# EAGLE design led_board (EAGLE 6.6.0)
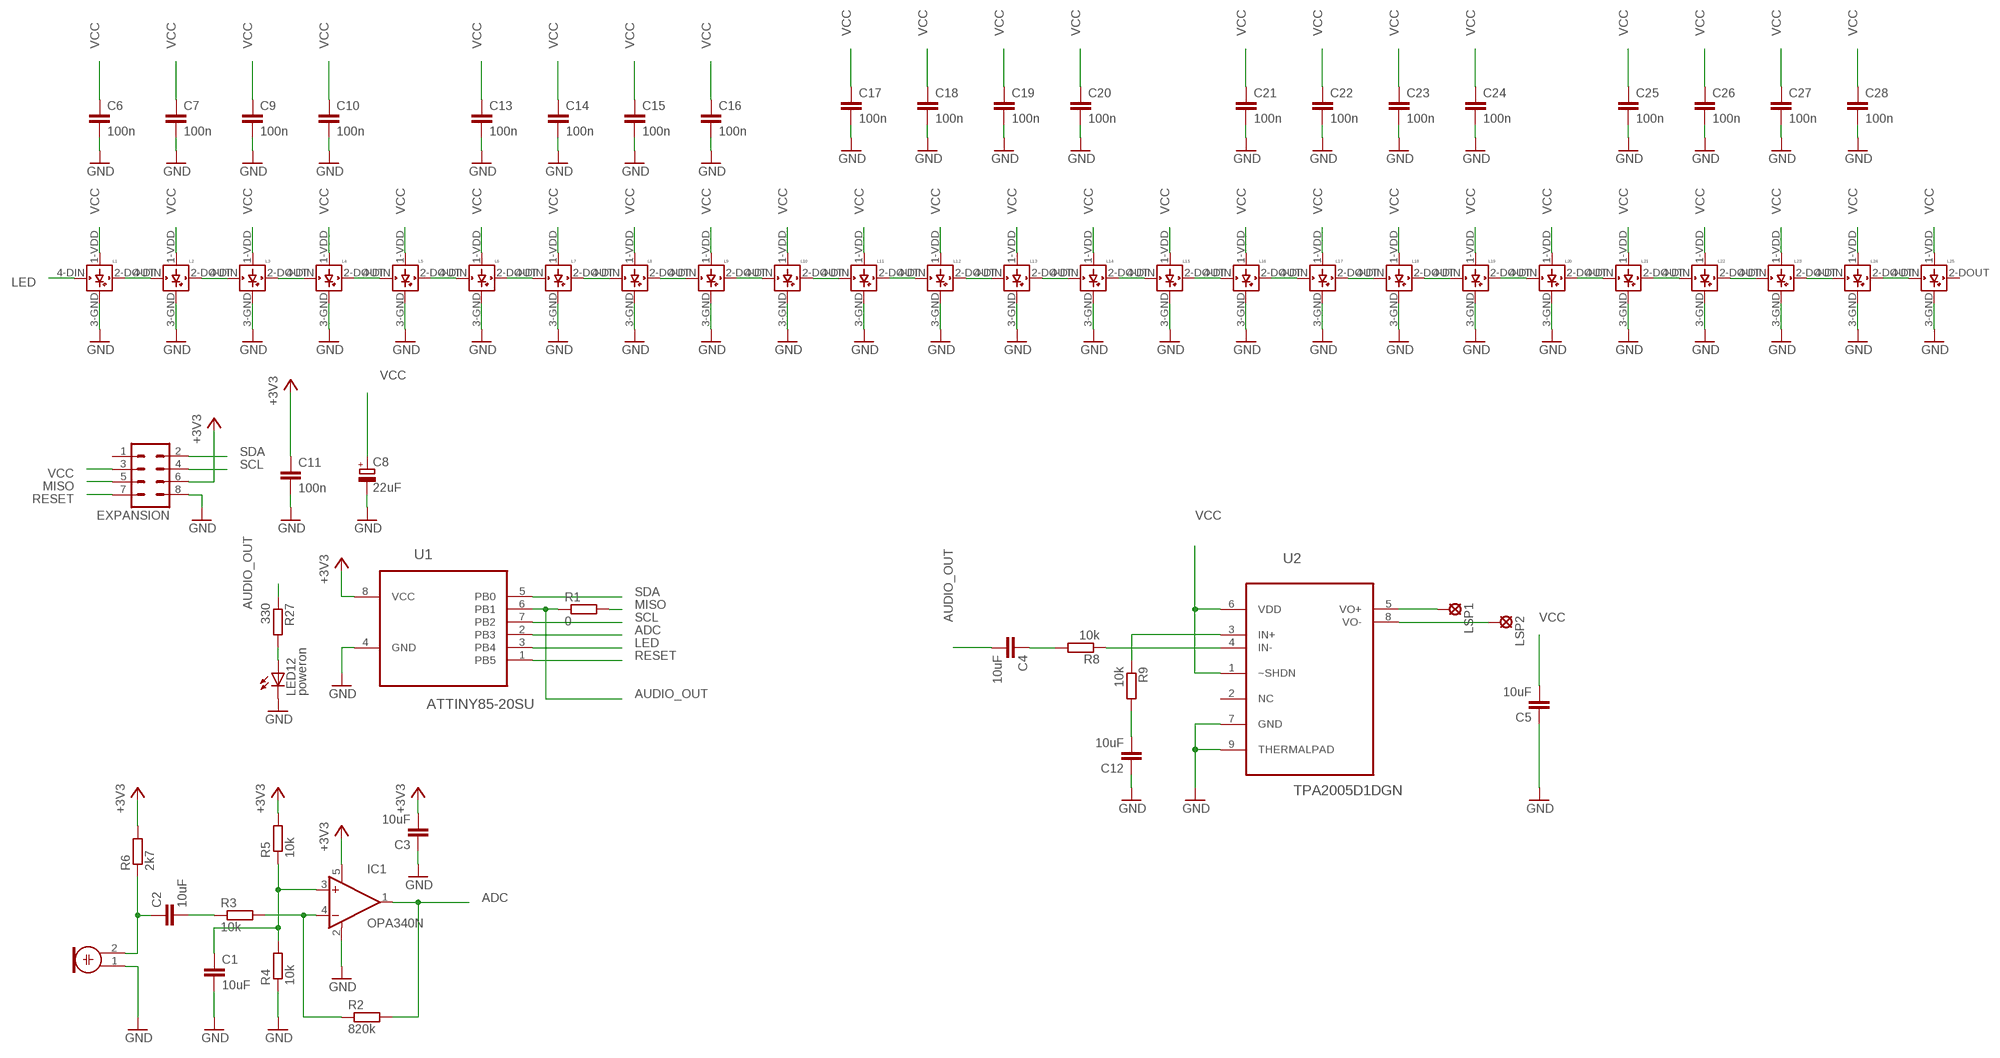
[diagram p0: schematic, sheet 1]

## Parts
C1  10uF  C-EUC0805  [C0805]
C2  10uF  C-EUC0805  [C0805]
C3  10uF  C-EUC0805  [C0805]
C4  10uF  C-EUC0805  [C0805]
C5  10uF  C-EUC0805  [C0805]
C6  100n  C-EUC0805  [C0805]
C7  100n  C-EUC0805  [C0805]
C8  22uF  CPOL-EU153CLV-0505  [153CLV-0505]
C9  100n  C-EUC0805  [C0805]
C10  100n  C-EUC0805  [C0805]
C11  100n  C-EUC0805  [C0805]
C12  10uF  C-EUC0805  [C0805]
C13  100n  C-EUC0805  [C0805]
C14  100n  C-EUC0805  [C0805]
C15  100n  C-EUC0805  [C0805]
C16  100n  C-EUC0805  [C0805]
C17  100n  C-EUC0805  [C0805]
C18  100n  C-EUC0805  [C0805]
C19  100n  C-EUC0805  [C0805]
C20  100n  C-EUC0805  [C0805]
C21  100n  C-EUC0805  [C0805]
C22  100n  C-EUC0805  [C0805]
C23  100n  C-EUC0805  [C0805]
C24  100n  C-EUC0805  [C0805]
C25  100n  C-EUC0805  [C0805]
C26  100n  C-EUC0805  [C0805]
C27  100n  C-EUC0805  [C0805]
C28  100n  C-EUC0805  [C0805]
EXPANSION  MA04-2  [MA04-2]
IC1  OPA340N  [SOT23-5]
L1  WS2812B  [WS2812B]
L2  WS2812B  [WS2812B]
L3  WS2812B  [WS2812B]
L4  WS2812B  [WS2812B]
L5  WS2812B  [WS2812B]
L6  WS2812B  [WS2812B]
L7  WS2812B  [WS2812B]
L8  WS2812B  [WS2812B]
L9  WS2812B  [WS2812B]
L10  WS2812B  [WS2812B]
L11  WS2812B  [WS2812B]
L12  WS2812B  [WS2812B]
L13  WS2812B  [WS2812B]
L14  WS2812B  [WS2812B]
L15  WS2812B  [WS2812B]
L16  WS2812B  [WS2812B]
L17  WS2812B  [WS2812B]
L18  WS2812B  [WS2812B]
L19  WS2812B  [WS2812B]
L20  WS2812B  [WS2812B]
L21  WS2812B  [WS2812B]
L22  WS2812B  [WS2812B]
L23  WS2812B  [WS2812B]
L24  WS2812B  [WS2812B]
L25  WS2812B  [WS2812B]
LED12  poweron  LEDCHIPLED_1206  [CHIPLED_1206]
LSP1  LSP10  [LSP10]
LSP2  LSP10  [LSP10]
M1  ELECTRET_MICROPHON-WM-61B  [WM-61B]
R1  0  R-EU_M0805  [M0805]
R2  820k  R-EU_M0805  [M0805]
R3  10k  R-EU_M0805  [M0805]
R4  10k  R-EU_M0805  [M0805]
R5  10k  R-EU_M0805  [M0805]
R6  2k7  R-EU_M0805  [M0805]
R8  10k  R-EU_M0805  [M0805]
R9  10k  R-EU_M0805  [M0805]
R27  330  R-EU_M0805  [M0805]
U1  ATTINY85-20SU  [SOIC127P798X216-8N]
U2  TPA2005D1DGN  [SOP65P488X107-9N]

## Nets
+3V3: C3.2 C11.1 EXPANSION.6 IC1.5(V+) R5.2 R6.2 U1.8(VCC)
ADC: IC1.1(OUT) R2.2 U1.2(PB3)
AUDIO_OUT: C4.2 R1.1 R27.1 U1.6(PB1)
GND: C1.2 C3.1 C5.1 C6.2 C7.2 C8.- C9.2 C10.2 C11.2 C12.1 C13.2 C14.2 C15.2 C16.2 C17.2 C18.2 C19.2 C20.2 C21.2 C22.2 C23.2 C24.2 C25.2 C26.2 C27.2 C28.2 EXPANSION.8 IC1.2(V-) L1.3-GND(GND) L2.3-GND(GND) L3.3-GND(GND) L4.3-GND(GND) L5.3-GND(GND) L6.3-GND(GND) L7.3-GND(GND) L8.3-GND(GND) L9.3-GND(GND) L10.3-GND(GND) L11.3-GND(GND) L12.3-GND(GND) L13.3-GND(GND) L14.3-GND(GND) L15.3-GND(GND) L16.3-GND(GND) L17.3-GND(GND) L18.3-GND(GND) L19.3-GND(GND) L20.3-GND(GND) L21.3-GND(GND) L22.3-GND(GND) L23.3-GND(GND) L24.3-GND(GND) L25.3-GND(GND) LED12.C M1.1 R4.1 U1.4(GND) U2.7(GND) U2.9(THERMALPAD)
LED: L1.4-DIN(DIN) U1.3(PB4)
LED1: L5.2-DOUT(DOUT) L6.4-DIN(DIN)
LED2: L15.2-DOUT(DOUT) L16.4-DIN(DIN)
LED3: L20.2-DOUT(DOUT) L21.4-DIN(DIN)
MISO: EXPANSION.5 R1.2
N$1: L1.2-DOUT(DOUT) L2.4-DIN(DIN)
N$2: L2.2-DOUT(DOUT) L3.4-DIN(DIN)
N$3: L3.2-DOUT(DOUT) L4.4-DIN(DIN)
N$4: L4.2-DOUT(DOUT) L5.4-DIN(DIN)
N$5: LSP1.MP U2.5(VO+)
N$6: L6.2-DOUT(DOUT) L7.4-DIN(DIN)
N$7: L7.2-DOUT(DOUT) L8.4-DIN(DIN)
N$8: L8.2-DOUT(DOUT) L9.4-DIN(DIN)
N$9: L9.2-DOUT(DOUT) L10.4-DIN(DIN)
N$13: L11.2-DOUT(DOUT) L12.4-DIN(DIN)
N$14: L12.2-DOUT(DOUT) L13.4-DIN(DIN)
N$15: L13.2-DOUT(DOUT) L14.4-DIN(DIN)
N$16: L14.2-DOUT(DOUT) L15.4-DIN(DIN)
N$17: L16.2-DOUT(DOUT) L17.4-DIN(DIN)
N$18: L17.2-DOUT(DOUT) L18.4-DIN(DIN)
N$19: L18.2-DOUT(DOUT) L19.4-DIN(DIN)
N$20: L19.2-DOUT(DOUT) L20.4-DIN(DIN)
N$21: L10.2-DOUT(DOUT) L11.4-DIN(DIN)
N$22: L21.2-DOUT(DOUT) L22.4-DIN(DIN)
N$23: LED12.A R27.2
N$24: L22.2-DOUT(DOUT) L23.4-DIN(DIN)
N$25: L23.2-DOUT(DOUT) L24.4-DIN(DIN)
N$26: L24.2-DOUT(DOUT) L25.4-DIN(DIN)
N$27: C2.2 R3.1
N$28: IC1.4(-IN) R2.1 R3.2
N$29: C2.1 M1.2 R6.1
N$30: C1.1 IC1.3(+IN) R4.2 R5.1
N$31: R8.1 U2.4(IN-)
N$32: LSP2.MP U2.8(VO-)
N$33: C4.1 R8.2
N$34: C12.2 R9.2
N$36: R9.1 U2.3(IN+)
RESET: EXPANSION.7 U1.1(PB5)
SCL: EXPANSION.4 U1.7(PB2)
SDA: EXPANSION.2 U1.5(PB0)
VCC: C5.2 C6.1 C7.1 C8.+ C9.1 C10.1 C13.1 C14.1 C15.1 C16.1 C17.1 C18.1 C19.1 C20.1 C21.1 C22.1 C23.1 C24.1 C25.1 C26.1 C27.1 C28.1 EXPANSION.3 L1.1-VDD(VDD) L2.1-VDD(VDD) L3.1-VDD(VDD) L4.1-VDD(VDD) L5.1-VDD(VDD) L6.1-VDD(VDD) L7.1-VDD(VDD) L8.1-VDD(VDD) L9.1-VDD(VDD) L10.1-VDD(VDD) L11.1-VDD(VDD) L12.1-VDD(VDD) L13.1-VDD(VDD) L14.1-VDD(VDD) L15.1-VDD(VDD) L16.1-VDD(VDD) L17.1-VDD(VDD) L18.1-VDD(VDD) L19.1-VDD(VDD) L20.1-VDD(VDD) L21.1-VDD(VDD) L22.1-VDD(VDD) L23.1-VDD(VDD) L24.1-VDD(VDD) L25.1-VDD(VDD) U2.1(~SHDN) U2.6(VDD)
Unconnected: EXPANSION.1 L25.2-DOUT(DOUT) U2.2(NC)

## Library data of the parts
C1-C7 C9-C28 = resistor:C-EU: CAPACITOR, European symbol
C8 = resistor:CPOL-EU: POLARIZED CAPACITOR, European symbol
EXPANSION = con-lstb:MA04-2: PIN HEADER; OC_FARNELL: unknown; OC_NEWARK: unknown
IC1 = burr-brown:OPA340: Rail-to-Rail Operational Amplifiers Single-Supply, MicroAmplifier(TM) Series; MPN: OPA340NA/3KG4; OC_FARNELL: 1234805; OC_NEWARK: 13M5177
L1-L25 = adafruit:WS2812B
LED12 = led:LED: LED OSRAM: - CHIPLED LG R971, LG N971, LY N971, LG Q971, LY Q971, LO R971, LY R971 LH N974, LH R974 LS Q976, LO Q976, LY Q976 LO Q996 - Hyper CHIPLED LW Q18S LB Q993, LB Q99A, LB R99A - SideLED LS A670, LO A670, LY A670, LG A670, LP A670 LB A673, LV A673, LT A673, LW A673 LH A674 LY A675 LS A676, LA A676, LO A676, LY A676, LW A676 LS A679, LY A679, LG A679 - Hyper Micro SIDELED® LS Y876, LA Y876, LO Y876, LY Y876 LT Y87S - SmartLED LW L88C, LW L88S LB L89C, LB L89S, LG L890 LS L89K, LO L89K, LY L89K LS L896, LA L896, LO L896, LY L896 - TOPLED LS T670, LO T670, LY T670, LG T670, LP T670 LSG T670, LSP T670, LSY T670, LOP T670, LYG T670 LG T671, LOG T671, LSG T671 LB T673, LV T673, LT T673, LW T673 LH T674 LS T676, LA T676, LO T676, LY T676, LB T676, LH T676, LSB T676, LW T676 LB T67C, LV T67C, LT T67C, LS T67K, LO T67K, LY T67K, LW E67C LS E67B, LA E67B, LO E67B, LY E67B, LB E67C, LV E67C, LT E67C LW T67C LS T679, LY T679, LG T679 LS T770, LO T770, LY T770, LG T770, LP T770 LB T773, LV T773, LT T773, LW T773 LH T774 LS E675, LA E675, LY E675, LS T675 LS T776, LA T776, LO T776, LY T776, LB T776 LHGB T686 LT T68C, LB T68C - Hyper Mini TOPLED® LB M676 - Mini TOPLED Santana® LG M470 LS M47K, LO M47K, LY M47K Source: http://www.osram.convergy.de LUXEON: - LUMILED® LXK2-PW12-R00, LXK2-PW12-S00, LXK2-PW14-U00, LXK2-PW14-V00 LXK2-PM12-R00, LXK2-PM12-S00, LXK2-PM14-U00 LXK2-PE12-Q00, LXK2-PE12-R00, LXK2-PE12-S00, LXK2-PE14-T00, LXK2-PE14-U00 LXK2-PB12-K00, LXK2-PB12-L00, LXK2-PB12-M00, LXK2-PB14-N00, LXK2-PB14-P00, LXK2-PB14-Q00 LXK2-PR12-L00, LXK2-PR12-M00, LXK2-PR14-Q00, LXK2-PR14-R00 LXK2-PD12-Q00, LXK2-PD12-R00, LXK2-PD12-S00 LXK2-PH12-R00, LXK2-PH12-S00 LXK2-PL12-P00, LXK2-PL12-Q00, LXK2-PL12-R00 Source: www.luxeon.com KINGBRIGHT: KA-3528ASYC Source: www.kingbright.com
LSP1 LSP2 = solpad:LSP10: SOLDER PAD drill 1.0 mm, distributor Buerklin, 12H555
M1 = microphon:ELECTRET_MICROPHON-: Electret Condenser Microphone
R1-R6 R8 R9 R27 = resistor:R-EU_: RESISTOR, European symbol
U1 = my_parts:ATTINY85-20SU: 8-bit Microcontroller with In-System Programmable Flash; MPN: ATTINY85-20SU; OC_FARNELL: 1455164; OC_NEWARK: 58M3797; PACKAGE: SOIC-8; SUPPLIER: Atmel
U2 = my_parts:TPA2005D1DGN: 1.4-W MONO FILTER-FREE CLASS-D AUDIO POWER AMPLIFIER; MPN: TPA2005D1DGN; OC_FARNELL: 2075395; OC_NEWARK: 82T3159; PACKAGE: MSOP-8; SUPPLIER: Texas Instruments

## Board
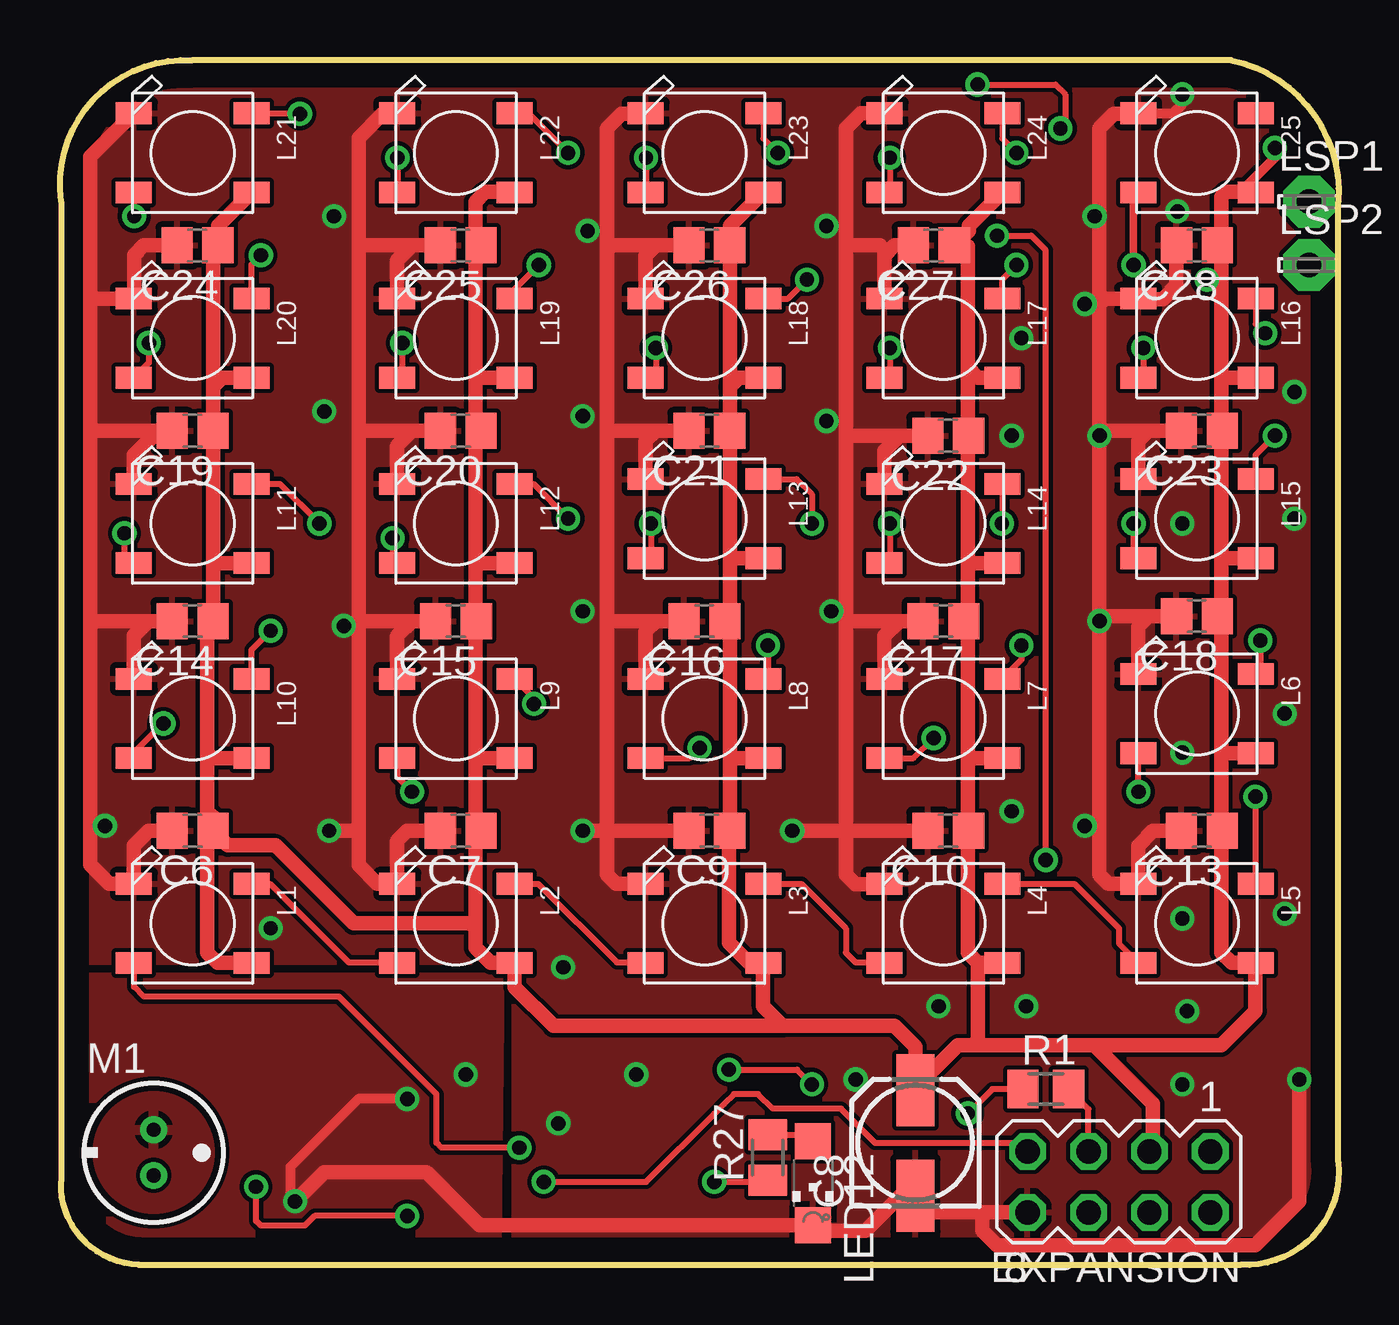
[diagram p1: board, top side]
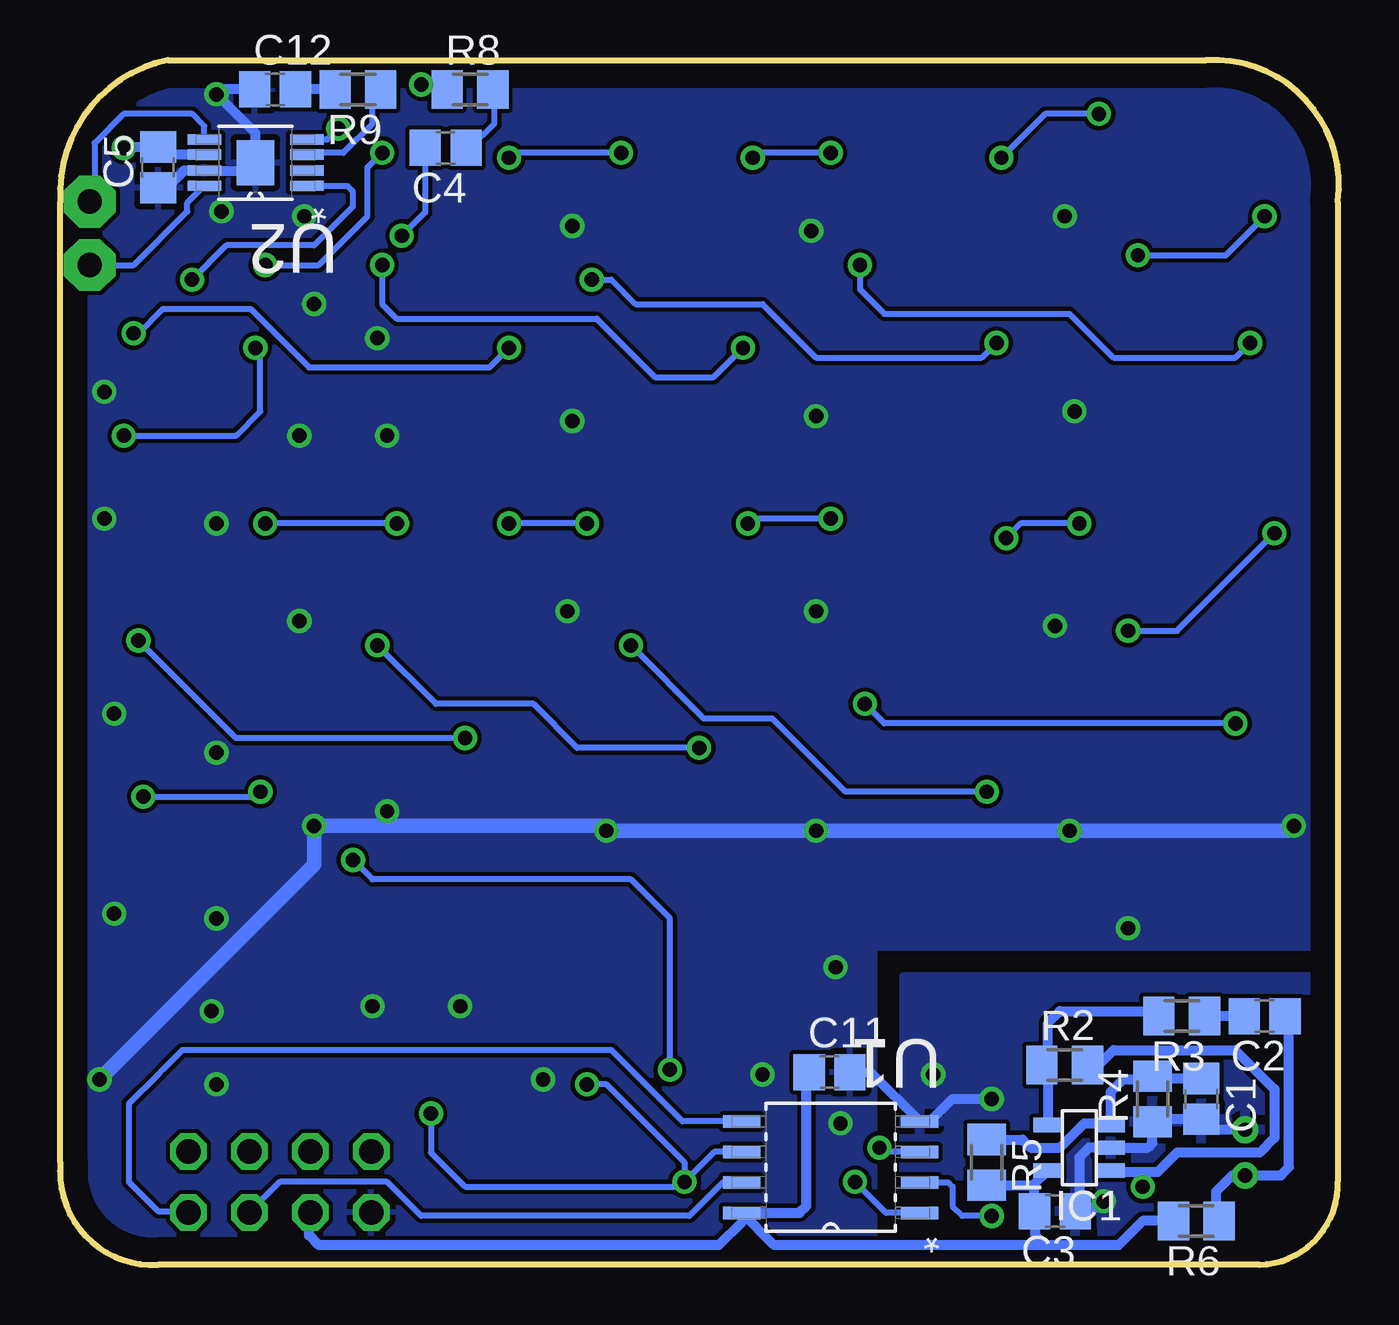
[diagram p2: board, bottom side, seen from below]

Size 53.3 x 50.2 mm. Coordinates in mm from the lower left corner, seen from the top.
Outline: 3.29,0 49.22,0 arc99 53.28,4.27 53.28,44.3 arc82 48.81,50.19 5.53,50.19 arc101 0.04,44.3 0.04,3.46 arc90 3.29,0
Copper layers (1*16): Top 0.035mm / dielectric 1.5mm / Bottom 0.035mm
Design rules "default *": minimum track width 7mil, minimum drill 24mil, track to track 7mil, track to pad 7mil, pad to pad 7mil, via to via 7mil, smd to smd 7mil, copper to edge 40mil, drill to drill 8mil, minimum pad ring 10mil, minimum via ring 8mil, stop-mask expansion 4mil, vias tented up to drill 0mil, thermal gap 10mil

### Footprints (pad centres in the part's own frame; a part is rotated, then mirrored left to right if it is on the bottom)
C0805 = smd 1.3 x 1.5: 1 -0.85,0; 2 0.85,0
153CLV-0505 = smd 3 x 1.6: + 2.2,0; - -2.2,0
MA04-2 = drill 1.016 octagon: 1 -3.81,-1.27; 2 -3.81,1.27; 3 -1.27,-1.27; 4 -1.27,1.27; 5 1.27,-1.27; 6 1.27,1.27; 7 3.81,-1.27; 8 3.81,1.27
SOT23-5 = smd 0.6 x 1.2: 1 -0.95,-1.306; 2 0,-1.306; 3 0.95,-1.306; 4 0.95,1.306; 5 -0.95,1.306
WS2812B = smd 1.5 x 0.9: 1-VDD 2.45,-1.65; 2-DOUT 2.45,1.65; 3-GND -2.45,1.65; 4-DIN -2.45,-1.65
CHIPLED_1206 = smd 1.5 x 1.5: A 0,-1.75; C 0,1.75
LSP10 = drill 1.016 pad 2.159 octagon: MP 0,0
WM-61B = drill 0.6 pad 1: 1 0,0.95; 2 0,-0.95
M0805 = smd 1.3 x 1.6: 1 -0.95,0; 2 0.95,0
SOIC127P798X216-8N = smd 1.549 x 0.533: 1 -3.708,1.905; 2 -3.708,0.635; 3 -3.708,-0.635; 4 -3.708,-1.905; 5 3.708,-1.905; 6 3.708,-0.635; 7 3.708,0.635; 8 3.708,1.905
SOP65P488X107-9N = smd 1.397 x 0.432: 1 -2.134,0.965; 2 -2.134,0.33; 3 -2.134,-0.33; 4 -2.134,-0.965; 5 2.134,-0.965; 6 2.134,-0.33; 7 2.134,0.33; 8 2.134,0.965 | smd 1.575 x 1.88: 9 0,0

### Placement (x,y rotation side)
C1  5.73,6.91 270 bottom
C2  3.09,10.37 180 bottom
C3  11.83,2.24 180 bottom
C4  37.23,46.54 180 bottom
C5  49.22,45.72 90 bottom
C6  5.53,18.09 180 top
C7  16.71,18.09 180 top
C8  35.65,5.08 90 top
C9  27.07,18.09 180 top
C10  37.03,18.09 180 top
C11  21.23,8.03 0 bottom
C12  44.34,48.97 0 bottom
C13  47.59,18.09 180 top
C14  5.53,26.82 180 top
C15  16.5,26.82 180 top
C16  26.87,26.82 180 top
C17  36.82,26.82 180 top
C18  47.39,27.03 180 top
C19  5.53,34.75 180 top
C20  16.71,34.75 180 top
C21  27.07,34.75 180 top
C22  37.03,34.55 180 top
C23  47.59,34.75 180 top
C24  5.73,42.47 180 top
C25  16.71,42.47 180 top
C26  27.07,42.47 180 top
C27  36.42,42.47 180 top
C28  47.39,42.47 180 top
EXPANSION  44.14,3.46 180 top
IC1  10.81,4.88 90 bottom
L1  5.53,14.23 0 top
L2  16.5,14.23 0 top
L3  26.87,14.23 0 top
L4  36.82,14.23 0 top
L5  47.39,14.23 0 top
L6  47.39,22.96 0 top
L7  36.82,22.76 0 top
L8  26.87,22.76 0 top
L9  16.5,22.76 0 top
L10  5.53,22.76 0 top
L11  5.53,30.89 0 top
L12  16.5,30.89 0 top
L13  26.87,31.09 0 top
L14  36.82,30.89 0 top
L15  47.39,31.09 0 top
L16  47.39,38.61 0 top
L17  36.82,38.61 0 top
L18  26.87,38.61 0 top
L19  16.5,38.61 0 top
L20  5.53,38.61 0 top
L21  5.53,46.33 0 top
L22  16.5,46.33 0 top
L23  26.87,46.33 0 top
L24  36.82,46.33 0 top
L25  47.39,46.33 0 top
LED12  31.39,3.41 180 top
LSP1  52.06,44.3 0 top
LSP2  52.06,41.66 0 top
M1  3.9,4.68 0 top
R1  41.09,7.32 0 top
R2  11.42,8.33 0 bottom
R3  6.55,10.37 180 bottom
R4  7.77,6.91 90 bottom
R5  14.67,4.27 270 bottom
R6  5.94,1.83 180 bottom
R8  36.21,48.97 0 bottom
R9  40.89,48.97 180 bottom
R27  29.51,4.47 90 top
U1  21.18,4.07 180 bottom
U2  45.15,45.93 180 bottom

### Tracks (layer width: path | path; a pad name or v marks a point on that pad's centre or on a via)
+3V3
  Bottom 0.406: R6.2 8.17,1.83 9.19,0.82 12.24,0.82 | 12.24,0.82 12.64,1.22 12.64,2.2 C3.2 12.68,3.37 | 12.68,3.37 IC1.5 | R5.2 12.73,3.32 12.68,3.37 | 12.24,0.82 23.54,0.82 U1.8 | U1.8 22.47,2.16 22.19,2.44 22.19,7.91 C11.1 | U1.8 24.88,1.78 25.85,0.82 42.51,0.82 42.92,1.22 42.92,2.14 EXPANSION.6
ADC  (via drill 0.6)
  Top 0.254: v14.47,2.03 10.61,2.03 10.2,1.63 8.37,1.63 8.17,1.83 v8.17,3.25
  Bottom 0.254: v8.17,3.25 8.17,3.46 8.58,3.86 | v14.47,2.03 15.69,2.03 16.1,2.44 16.1,3.25 16.27,3.43 U1.2
  Bottom 0.406: R2.2 10,8.33 9.39,8.94 4.31,8.94 2.69,7.32 2.69,5.29 3.29,4.68 6.75,4.68 7.56,3.86 8.58,3.86 9.44,3.86 IC1.1
AUDIO_OUT  (via drill 0.6)
  Top 0.254: v27.27,3.46 29.44,3.46 R27.1 | R1.1 38.85,7.32 v37.84,6.3 | v31.34,7.52 30.73,8.13 v27.88,8.13 | v39.06,42.88 40.48,42.88 41.09,42.27 v41.09,16.87
  Bottom 0.254: U1.6 26.03,4.7 v27.27,3.46 | v27.27,3.46 27.27,4.27 30.52,7.52 v31.34,7.52 | v37.84,6.3 37.84,4.68 36.42,3.25 27.48,3.25 v27.27,3.46 | v27.88,8.13 27.88,14.43 29.51,16.06 40.28,16.06 v41.09,16.87 | C4.2 38.08,43.86 v39.06,42.88
GND  (via drill 0.6)
  Top 0.406: v14.47,6.91 12.44,6.91 9.59,4.07 9.59,2.85 v9.8,2.64 | v46.78,48.77 46.78,48.36 46.37,47.96 44.96,47.96 L25.3-GND
  Top 0.61: EXPANSION.8 38.45,2.19 | 38.45,2.19 36.35,2.19 C8.- 35.03,2.88 33.57,1.42 31.62,1.42 LED12.C 17.49,1.66 15.28,3.86 11.02,3.86 v9.8,2.64 | 1.26,18.29 1.26,16.66 2.05,15.88 L1.3-GND 3.08,17.47 3.7,18.09 C6.2 | 1.26,18.29 1.26,26.62 | 1.26,26.62 1.26,34.55 | 1.26,34.55 1.26,40.24 | 1.26,40.24 1.26,46.16 L21.3-GND | 1.26,40.24 1.29,40.26 L20.3-GND 3.09,42.06 3.5,42.47 C24.2 | C19.2 4.11,34.75 | 4.11,34.75 1.47,34.75 1.26,34.55 | L11.3-GND 3.08,33.72 4.11,34.75 | C14.2 3.7,26.82 | 3.7,26.82 1.47,26.82 1.26,26.62 | L10.3-GND 3.08,26.2 3.7,26.82 | 12.44,18.09 12.44,16.66 13.23,15.88 L2.3-GND 14.05,17.67 14.47,18.09 C7.2 | 12.44,18.09 12.44,26.82 | 12.44,26.82 12.44,34.75 | 12.44,34.75 12.44,42.27 | 12.44,42.27 12.44,46.94 13.45,47.96 14.03,47.96 L22.3-GND | L19.3-GND 14.05,41.85 14.67,42.47 | 14.67,42.47 C25.2 | 14.67,42.47 12.64,42.47 12.44,42.27 | C20.2 14.67,34.75 | 14.67,34.75 12.44,34.75 | L12.3-GND 14.05,34.13 14.67,34.75 | L9.3-GND 14.05,26.2 14.67,26.82 C15.2 12.44,26.82 | L3.3-GND 23.18,15.88 22.8,16.26 22.8,18.09 | 22.8,18.09 22.8,18.29 | 22.8,18.29 22.8,26.82 | 22.8,26.82 22.8,34.55 | 22.8,34.55 22.8,42.27 | 22.8,42.27 22.8,47.35 23.41,47.96 24.39,47.96 L23.3-GND | L18.3-GND 24.42,42.05 24.83,42.47 C26.2 23.01,42.47 22.8,42.27 | L13.3-GND 24.42,34.33 24.83,34.75 C21.2 23.01,34.75 22.8,34.55 | L8.3-GND 24.42,26.41 24.83,26.82 C16.2 22.8,26.82 | C9.2 22.8,18.09 | L24.3-GND 33.39,47.98 32.76,47.35 32.76,42.47 | 32.76,42.47 32.76,34.55 | 32.76,34.55 32.76,26.82 | 32.76,26.82 32.76,18.09 | 32.76,18.09 32.76,16.26 33.17,15.85 34.35,15.85 L4.3-GND | C10.2 32.76,18.09 | 43.33,18.29 43.33,16.26 43.71,15.88 L5.3-GND 44.94,17.47 45.56,18.09 C13.2
  Top 0.61: 43.33,18.29 43.33,27.03 | 43.33,27.03 43.33,34.75 | 43.33,34.75 43.33,40.03 | 43.33,40.03 43.33,47.35 43.93,47.96 44.91,47.96 L25.3-GND | L15.3-GND 44.94,34.33 45.36,34.75 C23.2 43.33,34.75 | L6.3-GND 44.94,26.61 45.36,27.03 C18.2 43.33,27.03 | v21.79,18.09 22.6,18.09 22.8,18.29 | v11.22,18.09 12.44,18.09 | v1.87,18.29 1.26,18.29 | v42.72,18.29 43.33,18.29 | v30.52,18.09 32.76,18.09 | L7.3-GND 34.37,26.2 34.99,26.82 C17.2 32.76,26.82 | L14.3-GND 34.37,33.93 34.99,34.55 | 34.99,34.55 C22.2 | 34.99,34.55 32.76,34.55 | C27.2 34.79,42.47 34.37,42.05 L17.3-GND 34.37,42.28 34.18,42.47 32.76,42.47 | v51.66,7.72 51.66,2.64 49.83,0.82 39.06,0.82 38.45,1.42 38.45,2.19 | 43.33,40.03 43.55,40.26 L16.3-GND 44.96,40.24 45.97,40.24 46.54,40.81 C28.2
  Bottom 0.406: M1.1 5.3,5.63 C1.2 7.67,6.06 R4.1 7.77,5.08 7.97,4.88 IC1.2 10.41,4.88 10.81,4.47 10.81,2.4 | 10.81,2.4 C3.1 | v14.47,6.91 16.1,6.91 17.04,5.97 U1.4 19.53,8.03 C11.2 | 10.81,2.4 10.04,2.4 v9.8,2.64 | C5.1 48.98,45.11 48.61,45.11 48.13,45.6 U2.7 45.48,45.6 U2.9 45.15,47.14 v46.78,48.77 46.58,48.97 C12.1
  Bottom 0.61: v1.87,18.29 2.08,18.09 v11.22,18.09 v21.79,18.09 v30.52,18.09 30.73,18.29 v42.72,18.29 42.72,16.66 v51.66,7.72
  other vias: 16.91,7.93 42.72,40.03 40.07,38.61 39.67,34.55 43.33,34.55 51.45,36.38 51.45,31.09 46.78,30.89 51.05,22.96 46.78,21.34 51.05,14.63 46.78,14.43 43.12,43.69 24.02,7.93 20.77,5.9 33.17,7.72 40.28,10.77 46.98,10.57 36.62,10.77 46.78,7.52 46.58,43.89 20.97,12.4 8.78,14.02 11.83,26.62 21.79,27.23 21.79,35.36 11.02,35.56 11.42,43.69 21.99,43.08 31.95,43.28 31.95,35.16 32.15,27.23 43.33,26.82 39.67,18.9
  pour Bottom: -0.97,11.99 18.13,11.99 18.13,-8.13 -0.97,-8.13
  pour Top: -1.18,11.99 18.33,11.99 18.13,-4.47 -1.38,-4.47
  pour Bottom: -2.8,55.07 55.72,55.07 55.72,13.21 -2.8,13.21
  pour Top: -6.46,53.65 56.74,53.65 56.74,12.6 -6.46,12.6
  pour Bottom: 19.35,14.23 54.7,14.23 54.7,-4.06 19.35,-4.06
  pour Top: 18.94,16.87 53.69,16.87 53.69,-4.26 18.94,-4.26
LED  (via drill 0.6)
  Top 0.254: v19.14,4.88 15.89,4.88 15.69,5.08 15.69,7.11 11.63,11.18 3.5,11.18 3.09,11.58 L1.4-DIN
  Bottom 0.254: U1.3 18.97,4.7 v19.14,4.88
LED1  (via drill 0.6)
  Top 0.254: L5.2-DOUT 49.84,19.5 v49.83,19.51 | v44.95,19.71 L6.4-DIN
  Bottom 0.254: v49.83,19.51 45.15,19.51 v44.95,19.71
LED2  (via drill 0.6)
  Top 0.254: L15.2-DOUT 49.84,33.75 v50.64,34.55 | v45.15,38.2 45.15,37.18 L16.4-DIN
  Bottom 0.254: v50.64,34.55 45.97,34.55 44.95,35.56 44.95,38 v45.15,38.2
LED3  (via drill 0.6)
  Top 0.254: L20.2-DOUT 7.98,41.67 v8.37,42.06 | v3.09,43.69 3.09,44.67 L21.4-DIN
  Bottom 0.254: v8.37,42.06 4.72,42.06 v3.09,43.69
MISO
  Top 0.254: EXPANSION.5 42.87,6.49 R1.2
N$1
  Top 0.254: L1.2-DOUT 8.76,15.88 12.03,12.6 14.03,12.6 L2.4-DIN
N$2
  Top 0.254: L2.2-DOUT 19.93,15.88 23.21,12.6 24.39,12.6 L3.4-DIN
N$3
  Top 0.254: L3.2-DOUT 30.91,15.88 32.76,14.02 32.76,13.01 33.17,12.6 34.35,12.6 L4.4-DIN
N$4
  Top 0.254: L4.2-DOUT 42.28,15.88 44.14,14.02 44.14,13.38 L5.4-DIN
N$5
  Bottom 0.254: U2.5 47.29,47.45 47.8,47.96 50.64,47.96 51.86,46.74 51.86,44.5 LSP1.MP
N$6  (via drill 0.6)
  Top 0.254: L7.4-DIN 35.58,21.11 v36.42,21.95 | v50.03,26.01 50.03,24.81 L6.2-DOUT
  Bottom 0.254: v36.42,21.95 45.97,21.95 v50.03,26.01
N$7  (via drill 0.6)
  Top 0.254: L8.4-DIN 26.23,21.11 v26.66,21.54 | v40.07,25.81 40.07,25.21 L7.2-DOUT
  Bottom 0.254: v26.66,21.54 31.74,21.54 33.57,23.37 37.64,23.37 v40.07,25.81
N$8  (via drill 0.6)
  Top 0.254: L9.4-DIN 14.05,20.33 v14.67,19.71 | v29.51,25.81 29.51,24.6 L8.2-DOUT
  Bottom 0.254: v14.67,19.71 20.57,19.71 23.61,22.76 26.46,22.76 v29.51,25.81
N$9  (via drill 0.6)
  Top 0.254: L10.4-DIN 3.08,21.33 v4.31,22.56 | v19.75,23.37 19.75,23.61 L9.2-DOUT
  Bottom 0.254: v4.31,22.56 18.94,22.56 v19.75,23.37
N$13  (via drill 0.6)
  Top 0.254: L11.2-DOUT 9.16,32.54 v10.81,30.89 | v13.86,30.28 13.86,29.43 L12.4-DIN
  Bottom 0.254: v10.81,30.89 13.25,30.89 v13.86,30.28
N$14  (via drill 0.6)
  Top 0.254: L12.2-DOUT 19.73,32.54 v21.18,31.09 | v24.63,30.89 24.63,29.66 L13.4-DIN
  Bottom 0.254: v21.18,31.09 24.43,31.09 v24.63,30.89
N$15  (via drill 0.6)
  Top 0.254: L13.2-DOUT 30.7,32.74 31.34,32.11 v31.34,30.89 | v34.59,30.89 34.59,29.45 L14.4-DIN
  Bottom 0.254: v31.34,30.89 v34.59,30.89
N$16  (via drill 0.6)
  Top 0.254: L14.2-DOUT v39.27,30.9 v39.26,30.89 | v44.75,30.89 44.75,29.63 L15.4-DIN
  Bottom 0.254: v39.26,30.89 v44.75,30.89
N$17  (via drill 0.6)
  Top 0.254: L16.2-DOUT 49.84,39.21 v50.23,38.81 | v34.59,38.2 34.59,37.18 L17.4-DIN
  Bottom 0.254: v50.23,38.81 50.03,38.81 49.01,39.83 45.36,39.83 42.92,37.39 35.4,37.39 v34.59,38.2
N$18  (via drill 0.6)
  Top 0.254: L17.2-DOUT 39.27,41.06 v39.87,41.66 | v24.83,38.2 24.83,37.38 L18.4-DIN
  Bottom 0.254: v39.87,41.66 39.87,40.03 39.26,39.42 30.93,39.42 28.49,36.98 26.05,36.98 v24.83,38.2
N$19  (via drill 0.6)
  Top 0.254: L18.2-DOUT 30.34,40.26 v31.13,41.05 | v14.27,38.41 14.27,37.18 L19.4-DIN
  Bottom 0.254: v31.13,41.05 30.32,41.05 29.3,40.03 24.02,40.03 21.79,37.8 14.88,37.8 v14.27,38.41
N$20  (via drill 0.6)
  Top 0.254: L19.2-DOUT 18.95,40.65 v19.96,41.66 | v3.7,38.41 3.7,37.58 L20.4-DIN
  Bottom 0.254: v19.96,41.66 19.96,40.64 18.94,39.63 11.22,39.63 9.39,37.8 4.31,37.8 v3.7,38.41
N$21  (via drill 0.6)
  Top 0.254: L10.2-DOUT 7.98,25.62 v8.78,26.42 | v2.69,30.48 2.69,29.63 L11.4-DIN
  Bottom 0.254: v8.78,26.42 6.75,26.42 v2.69,30.48
N$22  (via drill 0.6)
  Top 0.254: L21.2-DOUT 9.98,47.98 v10,47.96 | v14.06,46.13 14.06,44.69 L22.4-DIN
  Bottom 0.254: v10,47.96 12.24,47.96 v14.06,46.13
N$23
  Top 0.254: R27.2 31.12,5.42 LED12.A
N$24  (via drill 0.6)
  Top 0.254: L22.2-DOUT 19.53,47.98 v21.18,46.33 | v24.43,46.13 24.43,44.69 L23.4-DIN
  Bottom 0.254: v21.18,46.33 24.22,46.33 v24.43,46.13
N$25  (via drill 0.6)
  Top 0.254: L23.2-DOUT 29.32,46.93 v29.91,46.33 | v34.59,46.13 34.59,44.9 L24.4-DIN
  Bottom 0.254: v29.91,46.33 34.38,46.33 v34.59,46.13
N$26  (via drill 0.6)
  Top 0.254: L24.2-DOUT 39.27,46.93 v39.87,46.33 | 45.12,44.5 L25.4-DIN
  Top 0.305: v44.75,41.66 44.75,44.49 L25.4-DIN
  Bottom 0.254: v44.75,41.66 42.51,41.66 40.48,43.69 40.48,45.72 v39.87,46.33
N$27
  Bottom 0.406: C2.2 R3.1
N$28
  Bottom 0.406: 12.12,8.08 R2.1 | 12.12,8.08 IC1.4 | 12.12,8.08 12.12,10.08 11.63,10.57 7.7,10.57 R3.2
N$29
  Bottom 0.406: R6.1 5.12,1.97 5.12,3.05 4.45,3.73 M1.2 2.42,3.73 2.08,4.07 2.08,10.2 C2.1
N$30
  Bottom 0.406: C1.1 7.67,7.76 R4.2 7.9,7.72 8.98,7.72 9.51,7.2 IC1.3 9.57,5.9 10.61,5.9 11.63,4.88 12.85,4.88 13.19,5.22 R5.1
N$31  (via drill 0.6)
  Top 0.254: v38.25,49.18 41.5,49.18 41.9,48.77 41.9,47.55 v41.7,47.35
  Bottom 0.254: v38.25,49.18 37.37,49.18 R8.1 | U2.4 42.16,46.89 v41.7,47.35
N$32
  Bottom 0.254: LSP2.MP 50.23,41.66 48,43.89 48,44.25 U2.8
N$33
  Bottom 0.254: C4.1 36.21,46.54 35.2,47.55 35.2,48.91 R8.2
N$34
  Bottom 0.406: R9.2 C12.2
N$36
  Bottom 0.254: R9.1 40.28,48.63 40.28,47.55 41.5,46.33 42.94,46.33 U2.3
RESET  (via drill 0.6)
  Top 0.254: v20.16,3.46 24.43,3.46 27.27,6.3 27.68,6.71 28.09,7.11 29.1,7.11 29.71,6.5 32.56,6.5 33.98,5.08 39.97,5.08 EXPANSION.7
  Bottom 0.254: U1.1 18.86,2.16 v20.16,3.46
SCL
  Bottom 0.254: U1.7 25.67,3.43 27.07,2.03 38.25,2.03 39.67,3.46 44.14,3.46 EXPANSION.4
SDA
  Bottom 0.254: U1.5 27.35,5.97 30.32,8.94 48.2,8.94 49.01,8.13 49.22,7.93 50.44,6.71 50.44,3.46 49.22,2.24 48,2.24 EXPANSION.2
VCC  (via drill 0.6)
  Top 0.254: v47.8,41.05 48.41,41.05
  Top 0.406: v50.64,46.54 50.64,46.13 49.22,44.71
  Top 0.61: C8.+ 35.65,7.37 | 35.65,7.37 37.43,9.15 38.04,9.15 | 38.04,9.15 43.12,9.15 | 43.12,9.15 45.56,6.71 45.56,4.88 EXPANSION.3 | C6.1 6.14,17.85 6.14,13.01 6.57,12.58 L1.1-VDD 8.35,12.58 | L10.1-VDD 6.37,21.11 6.14,21.34 | 6.14,21.34 6.14,26.58 C14.1 6.38,29.26 | C6.1 6.38,18.66 6.14,18.9 6.14,21.34 | 6.38,29.26 C19.1 6.38,36.58 | L11.1-VDD 6.4,29.24 6.38,29.26 | 6.38,36.58 6.38,42.27 C24.1 6.58,43.29 L21.1-VDD | L20.1-VDD 6.76,36.96 6.38,36.58 | 17.32,14.02 17.32,13.21 17.95,12.58 L2.1-VDD 18.95,11.57 20.57,9.96 30.12,9.96 | 17.32,14.02 17.32,17.88 | 17.32,17.88 17.32,21.14 | 17.32,21.14 17.32,26.62 | 17.32,26.62 17.32,29.26 | 17.32,29.26 17.32,34.95 | 17.32,34.95 17.32,36.78 | 17.32,36.78 17.32,42.47 | 17.32,42.47 17.32,44.3 17.72,44.71 18.93,44.71 L22.1-VDD | C25.1 17.32,42.47 | L19.1-VDD 17.49,36.96 17.32,36.78 | C20.1 17.52,34.75 17.32,34.95 | L12.1-VDD 17.34,29.24 17.32,29.26 | C15.1 17.35,26.66 17.32,26.62 | L9.1-VDD 17.34,21.11 17.32,21.14 | C7.1 17.52,18.09 17.32,17.88 | L23.1-VDD 27.92,43.29 C26.1 27.92,36.58 | 27.92,36.58 C21.1 27.92,29.26 | 27.92,29.26 27.92,27.03 | 27.92,27.03 27.92,21.14 | 27.92,21.14 27.92,18.7 | 27.92,18.7 C9.1 | 27.92,18.7 27.88,18.66 27.88,13.41 28.72,12.58 L3.1-VDD 29.3,10.77 30.12,9.96 | L8.1-VDD 27.94,21.11 27.92,21.14 | L13.1-VDD 28.1,29.44 27.92,29.26 | C16.1 27.92,27.03 | L18.1-VDD 28.3,36.96 27.92,36.58 | L4.1-VDD 38.27,12.58 | 38.27,12.58 37.84,13.01 37.84,18.09 | 37.84,18.09 37.84,21.14 | 37.84,21.14 37.84,27.03 | 37.84,27.03 37.84,29.06 | 37.84,29.06 37.84,34.75 | 37.84,34.75 37.84,37.39 | 37.84,37.39 37.84,42.43 C27.1 37.88,43.08 37.88,43.29 L24.1-VDD | L17.1-VDD 38.27,36.96 37.84,37.39
  Top 0.61: C22.1 37.88,34.71 37.84,34.75 | C17.1 37.67,26.86 37.84,27.03 | L14.1-VDD 38.02,29.24 37.84,29.06 | L7.1-VDD 37.86,21.11 37.84,21.14 | C10.1 37.84,18.09 | 48.41,18.49 48.41,13.01 48.84,12.58 L5.1-VDD 49.83,12.56 49.83,10.57 48.41,9.15 43.12,9.15 | 48.41,18.49 48.41,21.34 | 48.41,21.34 48.41,27.23 | 48.41,27.23 48.41,29.47 | 48.41,29.47 48.41,34.55 | 48.41,34.55 48.41,36.98 | 48.41,36.98 48.41,41.05 48.41,42.31 | 48.41,42.31 C28.1 | 48.41,42.31 48.41,44.5 48.61,44.71 49.22,44.71 49.81,44.71 L25.1-VDD | L16.1-VDD 48.43,36.96 48.41,36.98 | C23.1 48.44,34.58 48.41,34.55 | L15.1-VDD 48.43,29.44 48.41,29.47 | C18.1 48.24,27.07 48.41,27.23 | L6.1-VDD 48.43,21.31 48.41,21.34 | C13.1 48.44,18.46 48.41,18.49 | 38.27,12.58 38.27,9.37 38.04,9.15 | 35.65,7.37 35.65,9.1 34.79,9.96 30.12,9.96 | 17.32,14.02 17.11,14.23 12.24,14.23 8.98,17.48 6.99,17.48 C6.1
  Bottom 0.254: v47.8,41.05 46.37,42.47 42.72,42.47 41.09,44.1 41.09,44.71 41.34,44.96 U2.1
  Bottom 0.406: U2.6 49.1,46.26 C5.2 50.6,46.57 v50.64,46.54